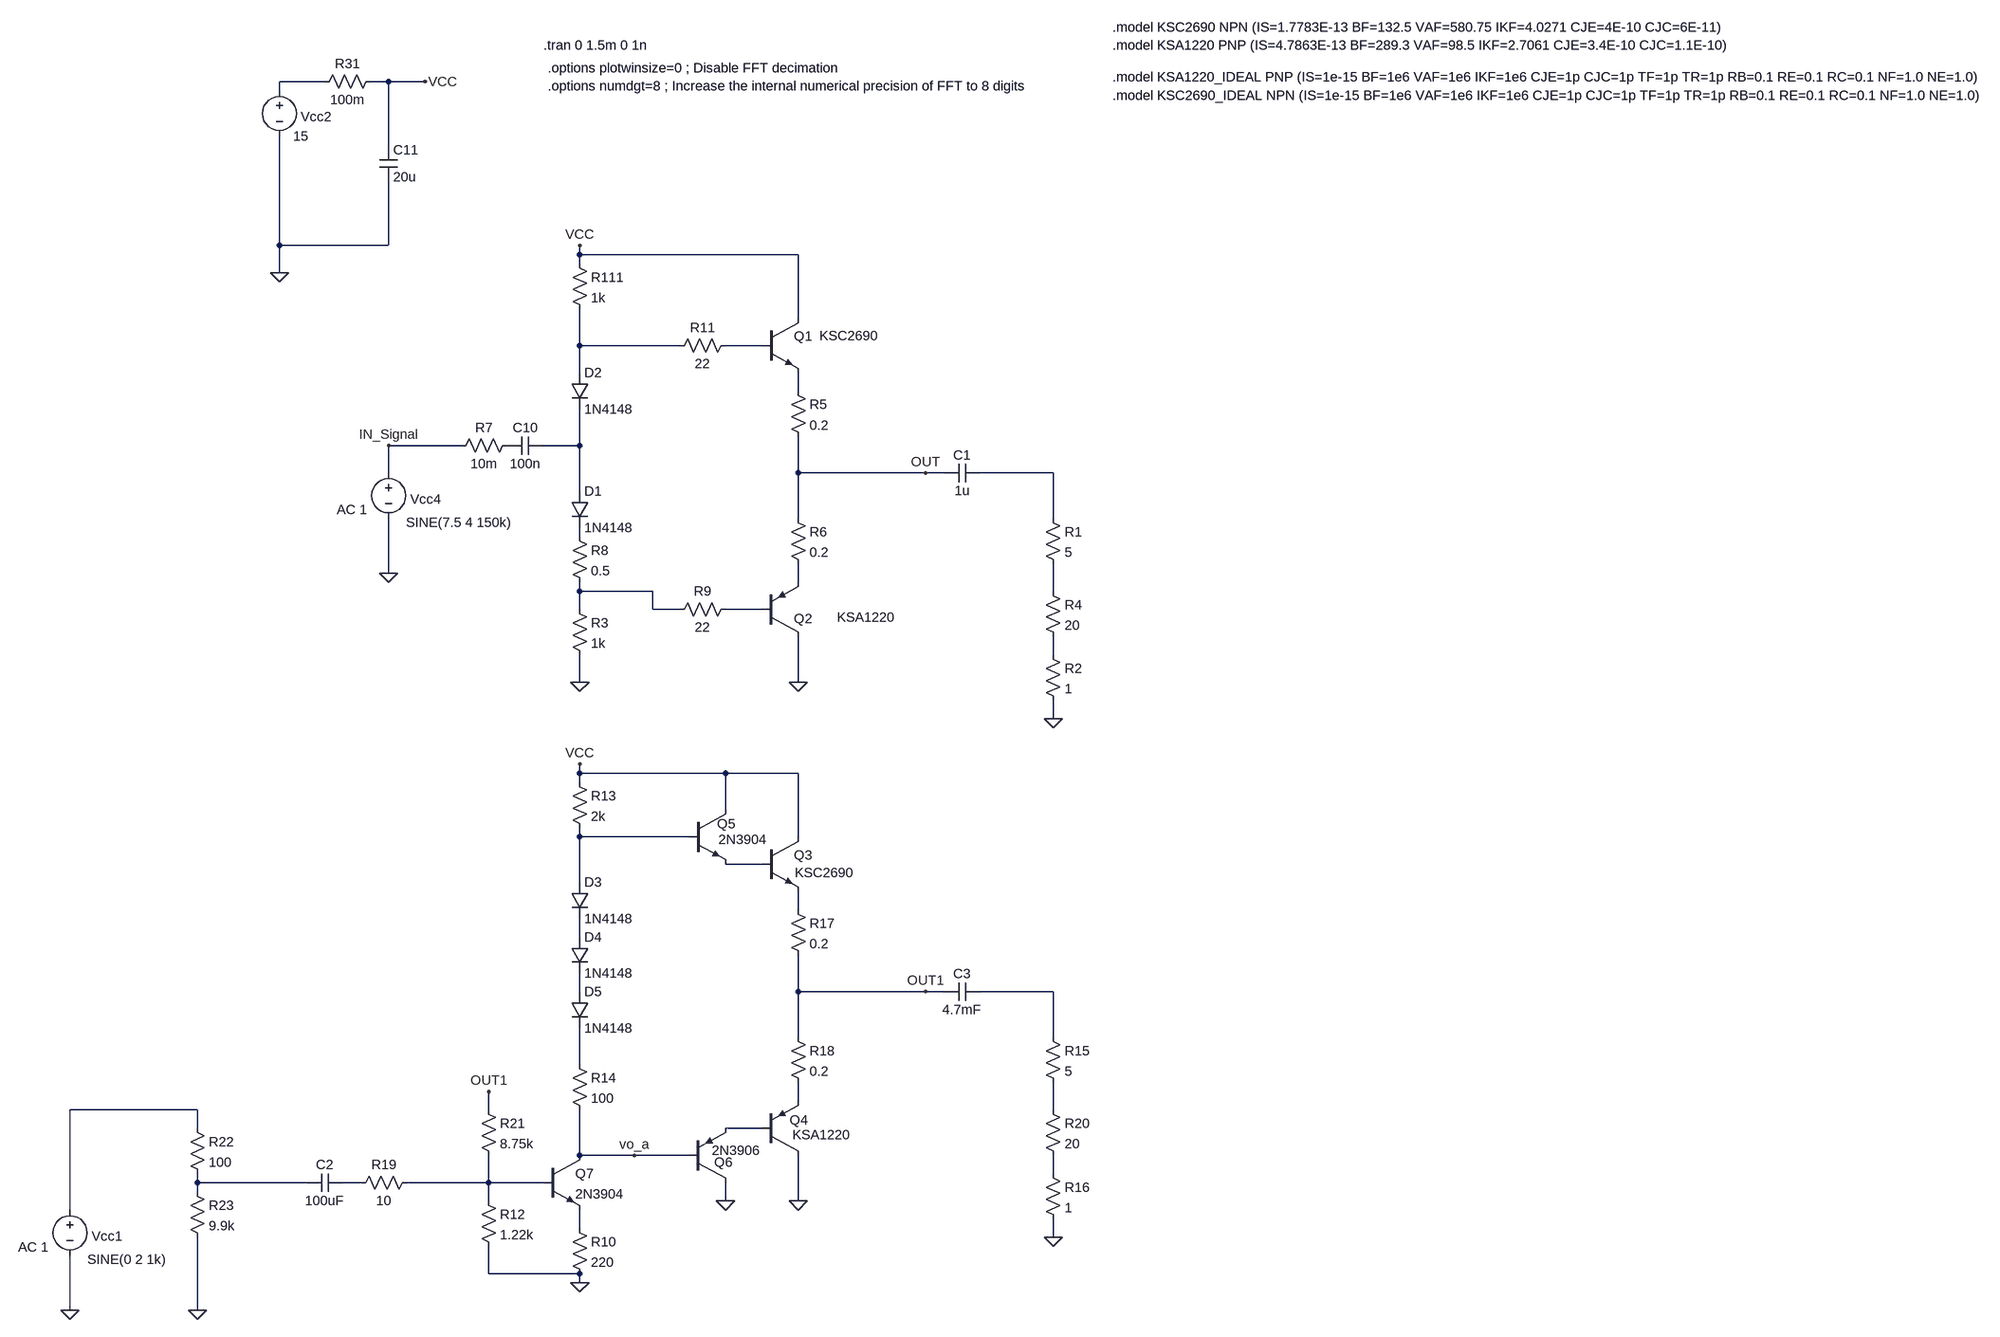
[diagram p0: schematic DIPS_Transmitter_Transient_Simv_StopCoil_Only_AB_Stage.asc]
DIPS_Transmitter_Transient_Simv_StopCoil_Only_AB_Stage.asc, the LTspice schematic file:
Version 4
SHEET 1 7284 15764
WIRE 2112 7440 2032 7440
WIRE 2224 7440 2192 7440
WIRE 2288 7440 2224 7440
WIRE 2032 7456 2032 7440
WIRE 2224 7552 2224 7440
WIRE 2032 7728 2032 7536
WIRE 2224 7728 2224 7616
WIRE 2224 7728 2032 7728
WIRE 2560 7744 2560 7728
WIRE 2944 7744 2560 7744
WIRE 2560 7760 2560 7744
WIRE 2032 7776 2032 7728
WIRE 2944 7856 2944 7744
WIRE 2560 7904 2560 7840
WIRE 2736 7904 2560 7904
WIRE 2880 7904 2816 7904
WIRE 2560 7952 2560 7904
WIRE 2944 7984 2944 7952
WIRE 2352 8080 2224 8080
WIRE 2560 8080 2560 8016
WIRE 2560 8080 2496 8080
WIRE 2224 8128 2224 8080
WIRE 2944 8128 2944 8064
WIRE 3168 8128 2944 8128
WIRE 3200 8128 3168 8128
WIRE 3392 8128 3264 8128
WIRE 2560 8160 2560 8080
WIRE 2944 8208 2944 8128
WIRE 3392 8208 3392 8128
WIRE 2560 8240 2560 8224
WIRE 2224 8304 2224 8208
WIRE 2944 8320 2944 8288
WIRE 2560 8336 2560 8320
WIRE 2688 8336 2560 8336
WIRE 3392 8336 3392 8288
WIRE 2560 8368 2560 8336
WIRE 2688 8368 2688 8336
WIRE 2736 8368 2688 8368
WIRE 2880 8368 2816 8368
WIRE 3392 8448 3392 8416
WIRE 2560 8496 2560 8448
WIRE 2944 8496 2944 8416
WIRE 3392 8560 3392 8528
WIRE 2560 8656 2560 8640
WIRE 2816 8656 2560 8656
WIRE 2944 8656 2816 8656
WIRE 2560 8672 2560 8656
WIRE 2816 8720 2816 8656
WIRE 2560 8768 2560 8752
WIRE 2752 8768 2560 8768
WIRE 2944 8768 2944 8656
WIRE 2880 8816 2816 8816
WIRE 2560 8848 2560 8768
WIRE 2944 8896 2944 8864
WIRE 2560 8944 2560 8912
WIRE 2560 9040 2560 9008
WIRE 2944 9040 2944 8976
WIRE 3168 9040 2944 9040
WIRE 3200 9040 3168 9040
WIRE 3392 9040 3264 9040
WIRE 2944 9120 2944 9040
WIRE 3392 9120 3392 9040
WIRE 2560 9168 2560 9104
WIRE 2944 9232 2944 9200
WIRE 1888 9248 1664 9248
WIRE 2400 9248 2400 9216
WIRE 3392 9248 3392 9200
WIRE 1888 9280 1888 9248
WIRE 2880 9280 2816 9280
WIRE 2560 9328 2560 9248
WIRE 2656 9328 2560 9328
WIRE 2752 9328 2656 9328
WIRE 3392 9360 3392 9328
WIRE 1888 9376 1888 9360
WIRE 2080 9376 1888 9376
WIRE 2176 9376 2144 9376
WIRE 2400 9376 2400 9328
WIRE 2400 9376 2256 9376
WIRE 2496 9376 2400 9376
WIRE 1888 9392 1888 9376
WIRE 2400 9408 2400 9376
WIRE 2816 9408 2816 9376
WIRE 2944 9408 2944 9328
WIRE 1664 9424 1664 9248
WIRE 2560 9456 2560 9424
WIRE 3392 9472 3392 9440
WIRE 2400 9536 2400 9488
WIRE 2560 9536 2400 9536
WIRE 2560 9552 2560 9536
WIRE 1664 9600 1664 9504
WIRE 1888 9600 1888 9472
FLAG 2288 7440 VCC
FLAG 2032 7776 0
FLAG 2224 8304 0
FLAG 2224 8080 IN_Signal
FLAG 2560 7728 VCC
FLAG 3168 8128 OUT
FLAG 2944 8496 0
FLAG 2560 8496 0
FLAG 3392 8560 0
FLAG 1664 9600 0
FLAG 2560 8640 VCC
FLAG 3168 9040 OUT1
FLAG 2944 9408 0
FLAG 3392 9472 0
FLAG 2816 9408 0
FLAG 2560 9552 0
FLAG 2400 9216 OUT1
FLAG 2656 9328 vo_a
FLAG 1888 9600 0
SYMBOL voltage 2032 7440 R0
WINDOW 123 0 0 Left 2
WINDOW 0 38 62 Left 2
WINDOW 39 0 0 Left 0
SYMATTR InstName Vcc2
SYMATTR Value 15
SYMBOL cap 2208 7552 R0
SYMATTR InstName C11
SYMATTR Value 20u
SYMATTR SpiceLine Rser=5m
SYMBOL res 2208 7424 R90
WINDOW 0 0 56 VBottom 2
WINDOW 3 32 56 VTop 2
SYMATTR InstName R31
SYMATTR Value 100m
SYMBOL voltage 2224 8112 R0
WINDOW 123 -91 81 Left 2
WINDOW 0 38 62 Left 2
WINDOW 39 0 0 Left 0
WINDOW 3 31 103 Left 2
SYMATTR Value2 AC 1
SYMATTR InstName Vcc4
SYMATTR Value SINE(7.5 4 150k)
SYMBOL cap 2496 8064 R90
WINDOW 0 0 32 VBottom 2
WINDOW 3 32 32 VTop 2
SYMATTR InstName C10
SYMATTR Value 100n
SYMBOL npn 2880 7856 R0
WINDOW 3 101 31 Left 2
SYMATTR InstName Q1
SYMATTR Value KSC2690
SYMBOL pnp 2880 8416 M180
WINDOW 3 132 34 Left 2
SYMATTR InstName Q2
SYMATTR Value KSA1220
SYMBOL res 2832 8352 R90
WINDOW 0 0 56 VBottom 2
WINDOW 3 32 56 VTop 2
SYMATTR InstName R9
SYMATTR Value 22
SYMBOL res 2832 7888 R90
WINDOW 0 0 56 VBottom 2
WINDOW 3 32 56 VTop 2
SYMATTR InstName R11
SYMATTR Value 22
SYMBOL res 2544 7744 R0
SYMATTR InstName R111
SYMATTR Value 1k
SYMBOL res 2544 8352 R0
SYMATTR InstName R3
SYMATTR Value 1k
SYMBOL res 3376 8192 R0
SYMATTR InstName R1
SYMATTR Value 5
SYMBOL res 3376 8432 R0
SYMATTR InstName R2
SYMATTR Value 1
SYMBOL res 2928 7968 R0
SYMATTR InstName R5
SYMATTR Value 0.2
SYMBOL res 2928 8192 R0
SYMATTR InstName R6
SYMATTR Value 0.2
SYMBOL diode 2544 8160 R0
SYMATTR InstName D1
SYMATTR Value 1N4148
SYMBOL diode 2544 7952 R0
SYMATTR InstName D2
SYMATTR Value 1N4148
SYMBOL cap 3264 8112 R90
WINDOW 0 0 32 VBottom 2
WINDOW 3 32 32 VTop 2
SYMATTR InstName C1
SYMATTR Value 1u
SYMBOL res 2448 8064 R90
WINDOW 0 0 56 VBottom 2
WINDOW 3 32 56 VTop 2
SYMATTR InstName R7
SYMATTR Value 10m
SYMBOL res 3376 8320 R0
SYMATTR InstName R4
SYMATTR Value 20
SYMBOL res 2544 8224 R0
SYMATTR InstName R8
SYMATTR Value 0.5
SYMBOL voltage 1664 9408 R0
WINDOW 123 -91 81 Left 2
WINDOW 0 38 62 Left 2
WINDOW 39 0 0 Left 0
WINDOW 3 31 103 Left 2
SYMATTR Value2 AC 1
SYMATTR InstName Vcc1
SYMATTR Value SINE(0 2 1k)
SYMBOL cap 2144 9360 R90
WINDOW 0 0 32 VBottom 2
WINDOW 3 32 32 VTop 2
SYMATTR InstName C2
SYMATTR Value 100uF
SYMBOL npn 2880 8768 R0
WINDOW 3 58 63 Left 2
SYMATTR InstName Q3
SYMATTR Value KSC2690
SYMBOL pnp 2880 9328 M180
WINDOW 0 49 62 Left 2
WINDOW 3 54 36 Left 2
SYMATTR InstName Q4
SYMATTR Value KSA1220
SYMBOL res 2544 8656 R0
SYMATTR InstName R13
SYMATTR Value 2k
SYMBOL res 2544 9152 R0
SYMATTR InstName R14
SYMATTR Value 100
SYMBOL res 3376 9104 R0
SYMATTR InstName R15
SYMATTR Value 5
SYMBOL res 3376 9344 R0
SYMATTR InstName R16
SYMATTR Value 1
SYMBOL res 2928 8880 R0
SYMATTR InstName R17
SYMATTR Value 0.2
SYMBOL res 2928 9104 R0
SYMATTR InstName R18
SYMATTR Value 0.2
SYMBOL cap 3264 9024 R90
WINDOW 0 0 32 VBottom 2
WINDOW 3 32 32 VTop 2
SYMATTR InstName C3
SYMATTR Value 4.7mF
SYMBOL res 2272 9360 R90
WINDOW 0 0 56 VBottom 2
WINDOW 3 32 56 VTop 2
SYMATTR InstName R19
SYMATTR Value 10
SYMBOL res 3376 9232 R0
SYMATTR InstName R20
SYMATTR Value 20
SYMBOL npn 2752 8720 R0
WINDOW 0 49 25 Left 2
WINDOW 3 52 53 Left 2
SYMATTR InstName Q5
SYMATTR Value 2N3904
SYMBOL pnp 2752 9376 M180
WINDOW 0 44 36 Left 2
WINDOW 3 40 57 Left 2
SYMATTR InstName Q6
SYMATTR Value 2N3906
SYMBOL diode 2544 8848 R0
SYMATTR InstName D3
SYMATTR Value 1N4148
SYMBOL diode 2544 8944 R0
SYMATTR InstName D4
SYMATTR Value 1N4148
SYMBOL diode 2544 9040 R0
SYMATTR InstName D5
SYMATTR Value 1N4148
SYMBOL npn 2496 9328 R0
SYMATTR InstName Q7
SYMATTR Value 2N3904
SYMBOL res 2544 9440 R0
SYMATTR InstName R10
SYMATTR Value 220
SYMBOL res 2384 9392 R0
SYMATTR InstName R12
SYMATTR Value 1.22k
SYMBOL res 2384 9232 R0
SYMATTR InstName R21
SYMATTR Value 8.75k
SYMBOL res 1872 9264 R0
SYMATTR InstName R22
SYMATTR Value 100
SYMBOL res 1872 9376 R0
SYMATTR InstName R23
SYMATTR Value 9.9k
TEXT 2496 7376 Left 2 !.tran 0 1.5m 0 1n
TEXT 3496 7344 Left 2 !.model KSC2690 NPN (IS=1.7783E-13 BF=132.5 VAF=580.75 IKF=4.0271 CJE=4E-10 CJC=6E-11)
TEXT 3496 7376 Left 2 !.model KSA1220 PNP (IS=4.7863E-13 BF=289.3 VAF=98.5 IKF=2.7061 CJE=3.4E-10 CJC=1.1E-10)
TEXT 3496 7464 Left 2 !.model KSC2690_IDEAL NPN (IS=1e-15 BF=1e6 VAF=1e6 IKF=1e6 CJE=1p CJC=1p TF=1p TR=1p RB=0.1 RE=0.1 RC=0.1 NF=1.0 NE=1.0)
TEXT 3496 7432 Left 2 !.model KSA1220_IDEAL PNP (IS=1e-15 BF=1e6 VAF=1e6 IKF=1e6 CJE=1p CJC=1p TF=1p TR=1p RB=0.1 RE=0.1 RC=0.1 NF=1.0 NE=1.0)
TEXT 2504 7416 Left 2 !.options plotwinsize=0 ; Disable FFT decimation
TEXT 2504 7448 Left 2 !.options numdgt=8 ; Increase the internal numerical precision of FFT to 8 digits

The netlist it stands for:
* DIPS_Transmitter_Transient_Simv_StopCoil_Only_AB_Stage.asc
Vcc2 N001 0 15
C11 VCC 0 20u Rser=5m
R31 VCC N001 100m
Vcc4 IN_Signal 0 SINE(7.5 4 150k) AC 1
C10 N005 P001 100n
Q1 VCC N003 N004 0 KSC2690
Q2 0 N011 N008 0 KSA1220
R9 N011 N009 22
R11 N003 N002 22
R111 VCC N002 1k
R3 N009 0 1k
R1 N006 N010 5
R2 N012 0 1
R5 N004 OUT 0.2
R6 OUT N008 0.2
D1 N005 N007 1N4148
D2 N002 N005 1N4148
C1 N006 OUT 1u
R7 P001 IN_Signal 10m
R4 N010 N012 20
R8 N007 N009 0.5
Vcc1 N021 0 SINE(0 2 1k) AC 1
C2 N026 N025 100uF
Q3 VCC N014 N015 0 KSC2690
Q4 0 N023 N020 0 KSA1220
R13 VCC N013 2k
R14 N019 vo_a 100
R15 N018 N022 5
R16 N024 0 1
R17 N015 OUT1 0.2
R18 OUT1 N020 0.2
C3 N018 OUT1 4.7mF
R19 N027 N026 10
R20 N022 N024 20
Q5 VCC N013 N014 0 2N3904
Q6 0 vo_a N023 0 2N3906
D3 N013 N016 1N4148
D4 N016 N017 1N4148
D5 N017 N019 1N4148
Q7 vo_a N027 N028 0 2N3904
R10 N028 0 220
R12 N027 0 1.22k
R21 OUT1 N027 8.75k
R22 N021 N025 100
R23 N025 0 9.9k
.model D D
.lib standard.dio
.model NPN NPN
.model PNP PNP
.lib standard.bjt
.tran 0 1.5m 0 1n
.model KSC2690 NPN (IS=1.7783E-13 BF=132.5 VAF=580.75 IKF=4.0271 CJE=4E-10 CJC=6E-11)
.model KSA1220 PNP (IS=4.7863E-13 BF=289.3 VAF=98.5 IKF=2.7061 CJE=3.4E-10 CJC=1.1E-10)
.model KSC2690_IDEAL NPN (IS=1e-15 BF=1e6 VAF=1e6 IKF=1e6 CJE=1p CJC=1p TF=1p TR=1p RB=0.1 RE=0.1 RC=0.1 NF=1.0 NE=1.0)
.model KSA1220_IDEAL PNP (IS=1e-15 BF=1e6 VAF=1e6 IKF=1e6 CJE=1p CJC=1p TF=1p TR=1p RB=0.1 RE=0.1 RC=0.1 NF=1.0 NE=1.0)
.options plotwinsize=0 ; Disable FFT decimation
.options numdgt=8 ; Increase the internal numerical precision of FFT to 8 digits
.backanno
.end